# Altium project Sampler_DIOT.PrjPCB (part 3 of 5)

## Sheet Supply_Sampler.SchDoc: Power Supply
size 420 x 297 mm; Author: G.K.; CompanyName: WUT; DrawnBy: G.K.; Organization: CERN; Address1: Warsaw Univeristy of Technology; Address2: Nowowiejska 15/19; DocumentNumber: 5; Revision: -; SheetNumber: 5; SheetTotal: 5; EDA_Number: ARTIQ; Projet: Sampler; ModifiedBy: -; CreateDate: XX/XX/XXXX; CheckedDate: -; Title2: converters + LDOs; DivGrp: ISE; Designer: G.K.; ModifiedDate: -; ProjectName: Sampler
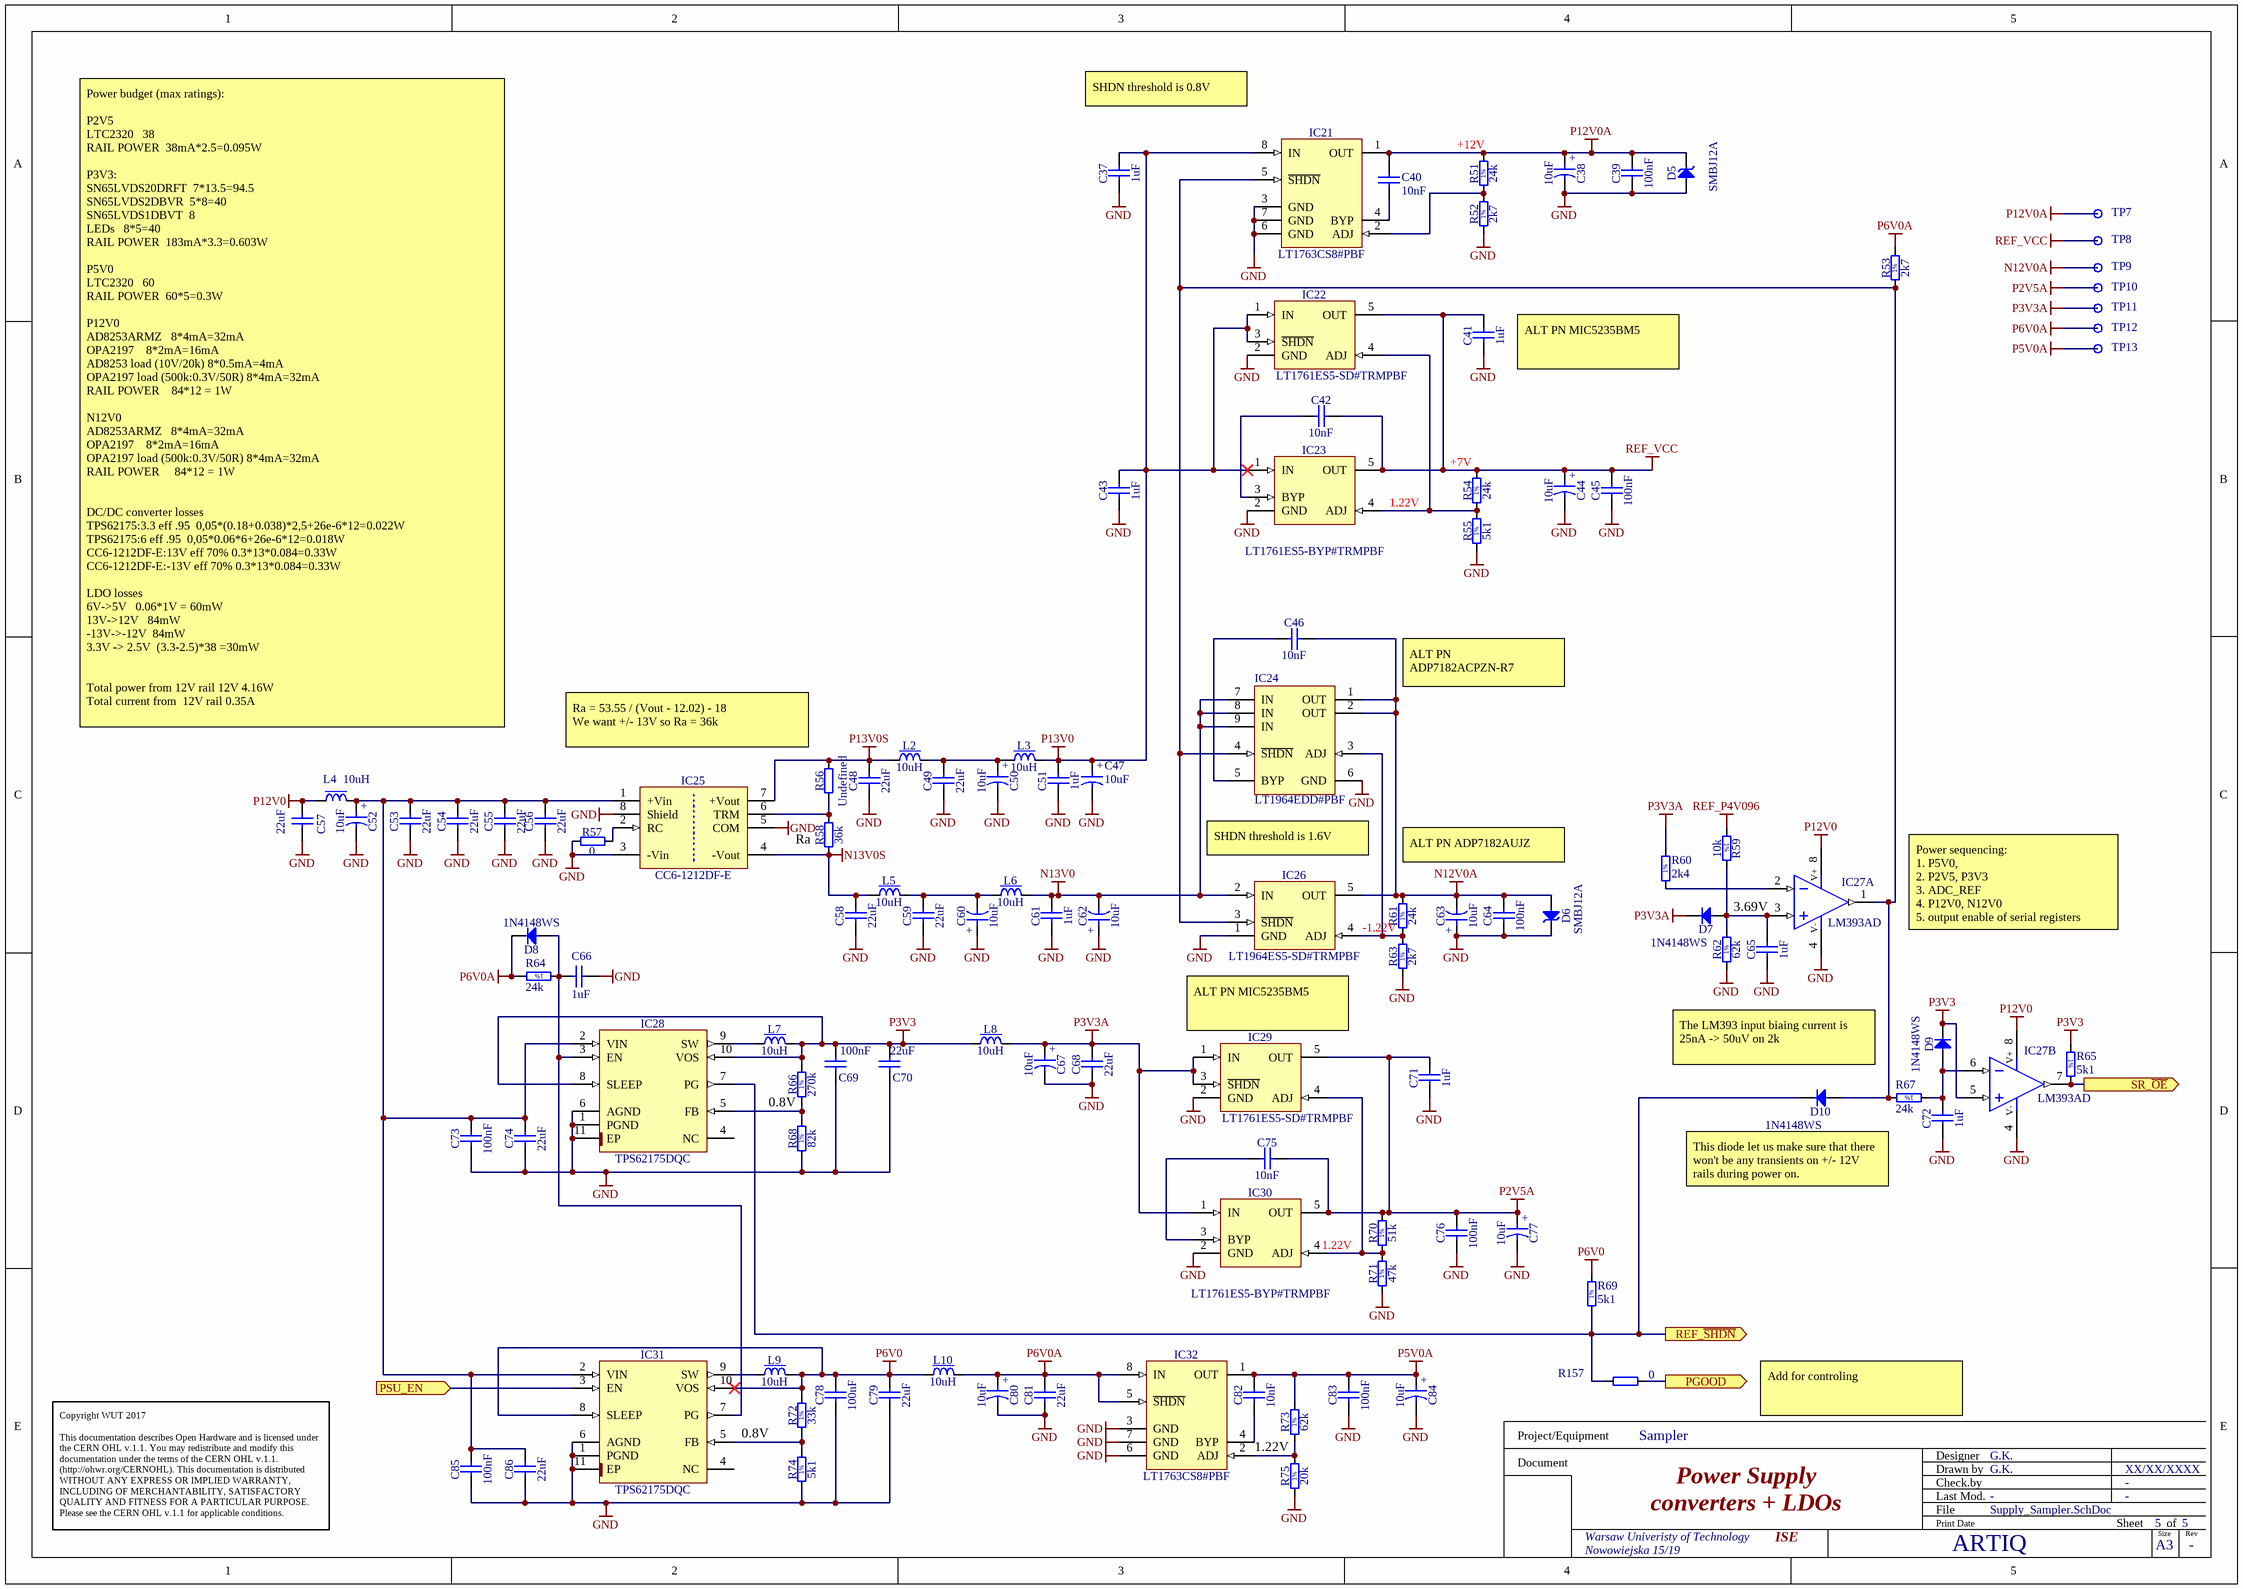
[diagram p3: Supply_Sampler.SchDoc]

### Parts
C37  1uF  [CAPC1608X87N]
C38  10uF  [CAPMP3216X180N]
C39  100nF  [CAPC1005X55N]
C40  10nF  [CAPC1608X87N]
C41  1uF  [CAPC1608X87N]
C42  10nF  [CAPC1608X87N]
C43  1uF  [CAPC1608X87N]
C44  10uF  [CAPMP3216X180N]
C45  100nF  [CAPC1005X55N]
C46  10nF  [CAPC1608X87N]
C47  10uF  [CAPMP3216X180N]
C48  22uF  [CAPC2012X135N]
C49  22uF  [CAPC2012X135N]
C50  10uF  [CAPMP3216X180N]
C51  1uF  [CAPC1608X87N]
C52  10uF  [CAPMP3216X180N]
C53  22uF  [CAPC2012X135N]
C54  22uF  [CAPC2012X135N]
C55  22uF  [CAPC2012X135N]
C56  22uF  [CAPC2012X135N]
C57  22uF  [CAPC2012X135N]
C58  22uF  [CAPC2012X135N]
C59  22uF  [CAPC2012X135N]
C60  10uF  [CAPMP3216X180N]
C61  1uF  [CAPC1608X87N]
C62  10uF  [CAPMP3216X180N]
C63  10uF  [CAPMP3216X180N]
C64  100nF  [CAPC1005X55N]
C65  1uF  [CAPC1608X87N]
C66  1uF  [CAPC1608X87N]
C67  10uF  [CAPMP3216X180N]
C68  22uF  [CAPC2012X135N]
C69  100nF  [CAPC1005X55N]
C70  22uF  [CAPC2012X135N]
C71  1uF  [CAPC1608X87N]
C72  1uF  [CAPC1608X87N]
C73  100nF  [CAPC1005X55N]
C74  22uF  [CAPC2012X135N]
C75  10nF  [CAPC1608X87N]
C76  100nF  [CAPC1005X55N]
C77  10uF  [CAPMP3216X180N]
C78  100nF  [CAPC1005X55N]
C79  22uF  [CAPC2012X135N]
C80  10uF  [CAPMP3216X180N]
C81  22uF  [CAPC2012X135N]
C82  10nF  [CAPC1608X87N]
C83  100nF  [CAPC1005X55N]
C84  10uF  [CAPMP3216X180N]
C85  100nF  [CAPC1005X55N]
C86  22uF  [CAPC2012X135N]
D5  SMBJ12A  [DIOM5336X265N]
D6  SMBJ12A  [DIOM5336X265N]
D7  1N4148WS  [SODFL2512X100N]
D8  1N4148WS  [SODFL2512X100N]
D9  1N4148WS  [SODFL2512X100N]
D10  1N4148WS  [SODFL2512X100N]
IC21  LT1763CS8#PBF  [SOIC127P600X175-8N]
IC22  LT1761ES5-SD#TRMPBF  [SOT95P280X100-5N]
IC23  LT1761ES5-BYP#TRMPBF  [SOT95P280X100-5N]
IC24  LT1964EDD#PBF  [LT-DD-8_V]
IC25  CC6-1212DF-E  [CC6-1212DF-E]
IC26  LT1964ES5-SD#TRMPBF  [SOT95P280X100-5N]
IC27  LM393AD  [SOIC127P600X175-8N]  (parts A,B of 2)
IC28  TPS62175DQC  [SON50P200X300X80-11N-R94X250]
IC29  LT1761ES5-SD#TRMPBF  [SOT95P280X100-5N]
IC30  LT1761ES5-BYP#TRMPBF  [SOT95P280X100-5N]
IC31  TPS62175DQC  [SON50P200X300X80-11N-R94X250]
IC32  LT1763CS8#PBF  [SOIC127P600X175-8N]
L2  10uH  [IND_MURATA-PS_8400]
L3  10uH  [IND_MURATA-PS_8400]
L4  10uH  [IND_MURATA-PS_8400]
L5  10uH  [IND_MURATA-PS_8400]
L6  10uH  [IND_MURATA-PS_8400]
L7  10uH  [IND_MURATA-PS_8400]
L8  10uH  [IND_MURATA-PS_8400]
L9  10uH  [IND_MURATA-PS_8400]
L10  10uH  [IND_MURATA-PS_8400]
R51  24k  [RESC1608X55N]
R52  2k7  [RESC1608X55N]
R53  2k7  [RESC1608X55N]
R54  24k  [RESC1608X55N]
R55  5k1  [RESC1005X40N]
R56  Undefined  [RESC1608X55N]
R57  0  [RESC1005X40N]
R58  36k  [RESC1608X55N]
R59  10k  [RESC1005X40N]
R60  2k4  [RESC1005X40N]
R61  24k  [RESC1608X55N]
R62  62k  [RESC1005X40N]
R63  2k7  [RESC1608X55N]
R64  24k  [RESC1608X55N]
R65  5k1  [RESC1005X40N]
R66  270k  [RESC1608X55N]
R67  24k  [RESC1608X55N]
R68  82k  [RESC1608X55N]
R69  5k1  [RESC1005X40N]
R70  51k  [RESC1005X40N]
R71  47k  [RESC1005X40N]
R72  33k  [RESC1005X40N]
R73  62k  [RESC1005X40N]
R74  5k1  [RESC1005X40N]
R75  20k  [RESC1005X40N]
R157  0  [RESC1005X40N]
TP7  Test Point  [TPS127]  (value not drawn)  (no BOM)
TP8  Test Point  [TPS127]  (value not drawn)  (no BOM)
TP9  Test Point  [TPS127]  (value not drawn)  (no BOM)
TP10  Test Point  [TPS127]  (value not drawn)  (no BOM)
TP11  Test Point  [TPS127]  (value not drawn)  (no BOM)
TP12  Test Point  [TPS127]  (value not drawn)  (no BOM)
TP13  Test Point  [TPS127]  (value not drawn)  (no BOM)

### Ports
PGOOD (out), PSU_EN (in), REF_~{SHDN} (out), SR_~{OE} (out)

### Nets
GND: C37.1 C38.2 C39.1 C41.1 C43.1 C44.2 C45.1 C47.2 C48.1 C49.1 C50.2 C51.1 C52.2 C53.1 C54.1 C55.1 C56.1 C57.1 C58.1 C59.1 C60.1 C61.1 C62.1 C63.1 C64.1 C65.1 C66.1 C67.2 C68.1 C69.1 C70.1 C71.1 C72.1 C73.1 C74.1 C76.1 C77.2 C78.1 C79.1 C80.2 C81.1 C83.1 C84.2 C85.1 C86.1 D5.2(A) D6.1(C) IC21.3(GND) IC21.6(GND) IC21.7(GND) IC22.2(GND) IC23.2(GND) IC24.6(GND) IC25.3(-Vin) IC25.5(COM) IC25.8(Shield) IC26.1(GND) IC27.4(V-) IC28.1(PGND) IC28.6(AGND) IC28.11(EP) IC29.2(GND) IC30.2(GND) IC31.1(PGND) IC31.6(AGND) IC31.11(EP) IC32.3(GND) IC32.6(GND) IC32.7(GND) R52.1 R55.1 R57.1 R62.1 R63.1 R68.1 R71.1 R74.1 R75.1
N12V0A: C46.2 C63.2 C64.2 D6.2(A) IC24.1(OUT) IC24.2(OUT) IC26.5(OUT) R61.2 TP9.1
N13V0: C61.2 C62.2 IC24.7(IN) IC24.8(IN) IC24.9(IN) IC26.2(IN) L6.2
N13V0S: C58.2 IC25.4(-Vout) L5.1 R58.1
P2V5A: C71.2 C75.2 C76.2 C77.1 IC29.5(OUT) IC30.5(OUT) R70.2 TP10.1
P3V3: C69.2 C70.2 D9.1(C) IC27.5(IN+) IC28.8(SLEEP) IC28.10(VOS) L7.2 L8.1 R65.1 R66.2
P3V3A: C67.1 C68.2 D7.1(C) IC29.1(IN) IC29.3(~{SHDN}) IC30.1(IN) L8.2 R60.2 TP11.1
P5V0A: C82.2 C83.2 C84.1 IC32.1(OUT) R73.2 TP13.1
P6V0: C78.2 C79.2 IC31.8(SLEEP) IC31.10(VOS) L9.2 L10.1 R69.2 R72.2
P6V0A: C80.1 C81.2 D8.1(C) IC32.5(~{SHDN}) IC32.8(IN) L10.2 R53.2 R64.2 TP12.1
P12V0: C57.2 IC27.8(V+) L4.1
P12V0A: C38.1 C39.2 C40.2 D5.1(C) IC21.1(OUT) R51.2 TP7.1
P13V0: C37.2 C43.2 C47.1 C51.2 IC21.8(IN) IC22.1(IN) IC22.3(~{SHDN}) IC23.1(IN) L3.2
P13V0S: C48.2 IC25.7(+Vout) L2.1 R56.2
REF_P4V096: R59.1
REF_VCC: C41.2 C42.2 C44.1 C45.2 IC22.5(OUT) IC23.5(OUT) R54.2 TP8.1
~{OE}: IC27.7(OUT) R65.2 ; port SR_~{OE}
PSU_EN: IC31.3(EN) ; port PSU_EN
NetC40_1: C40.1 IC21.4(BYP)
NetC42_1: C42.1 IC23.3(BYP)
NetC46_1: C46.1 IC24.5(BYP)
NetC49_2: C49.2 C50.1 L2.2 L3.1
NetC52_1: C52.1 C53.2 C54.2 C55.2 C56.2 C73.2 C74.2 C85.2 C86.2 IC25.1(+Vin) IC28.2(VIN) IC31.2(VIN) L4.2
NetC59_2: C59.2 C60.2 L5.2 L6.1
NetC65_2: C65.2 D7.2(A) IC27.3(IN+) R59.2 R62.2
NetC66_2: C66.2 D8.2(A) IC28.3(EN) IC31.7(PG) R64.1
NetC72_2: C72.2 D9.2(A) IC27.6(IN-) R67.1
NetC75_1: C75.1 IC30.3(BYP)
NetC82_1: C82.1 IC32.4(BYP)
NetD10_1: D10.1(C) IC28.7(PG) R69.1 R157.1 ; port REF_~{SHDN}
NetD10_2: D10.2(A) IC21.5(~{SHDN}) IC24.4(~{SHDN}) IC26.3(~{SHDN}) IC27.1(OUT) R53.1 R67.2
NetIC21_2: IC21.2(ADJ) R51.1 R52.2
NetIC22_4: IC22.4(ADJ) IC23.4(ADJ) R54.1 R55.2
NetIC24_3: IC24.3(ADJ) IC26.4(ADJ) R61.1 R63.2
NetIC25_2: IC25.2(RC) R57.2
NetIC25_6: IC25.6(TRM) R56.1 R58.2
NetIC27_2: IC27.2(IN-) R60.1
NetIC28_5: IC28.5(FB) R66.1 R68.2
NetIC28_9: IC28.9(SW) L7.1
NetIC29_4: IC29.4(ADJ) IC30.4(ADJ) R70.1 R71.2
NetIC31_5: IC31.5(FB) R72.1 R74.2
NetIC31_9: IC31.9(SW) L9.1
NetIC32_2: IC32.2(ADJ) R73.1 R75.2
NetR102_1: R157.2 ; port PGOOD

Not connected (* = marked no-connect by the designer): IC28 4(NC); IC31 4(NC)

### Notes on the sheet
- SHDN threshold is 0.8V
- (near R51) +12V
- (near C41) ALT PN MIC5235BM5
- (near IC23) 1.22V
- (near R54) +7V
- Power budget (max ratings):
  P2V5
  LTC2320			38
  RAIL POWER		38mA*2.5=0.095W
  P3V3:
  SN65LVDS20DRFT		7*13.5=94.5
  SN65LVDS2DBVR		5*8=40
  SN65LVDS1DBVT		8
  LEDs			8*5=40
  RAIL POWER		183mA*3.3=0.603W
  P5V0
  LTC2320			60
  RAIL POWER		60*5=0.3W
  P12V0
  AD8253ARMZ 		8*4mA=32mA
  OPA2197 			8*2mA=16mA
  AD8253 load (10V/20k)	8*0.5mA=4mA
  OPA2197 load (500k:0.3V/50R)	8*4mA=32mA
  RAIL POWER 		 84*12 = 1W
  N12V0
  AD8253ARMZ 		8*4mA=32mA
  OPA2197 			8*2mA=16mA
  OPA2197 load (500k:0.3V/50R)	8*4mA=32mA
  RAIL POWER  		 84*12 = 1W
  DC/DC converter losses
  TPS62175:3.3 eff .95		0,05*(0.18+0.038)*2,5+26e-6*12=0.022W
  TPS62175:6 eff .95		0,05*0.06*6+26e-6*12=0.018W
  CC6-1212DF-E:13V eff 70%	0.3*13*0.084=0.33W
  CC6-1212DF-E:-13V eff 70%	0.3*13*0.084=0.33W
  LDO losses
  6V->5V			0.06*1V = 60mW
  13V->12V			84mW
  -13V->-12V		84mW
  3.3V -> 2.5V		(3.3-2.5)*38 =30mW
  Total power from 12V rail	12V 4.16W
  Total current from  12V rail	0.35A
- ALT PN ADP7182ACPZN-R7
- (near R56) Ra = 53.55 / (Vout - 12.02) - 18
  We want +/- 13V so Ra = 36k
- (near R58) Ra
- SHDN threshold is 1.6V
- ALT PN ADP7182AUJZ
- -1.22V
- 3.69V
- Power sequencing:
  1. P5V0,
  2. P2V5, P3V3
  3. ADC_REF
  4. P12V0, N12V0
  5. output enable of serial registers
- ALT PN MIC5235BM5
- The LM393 input biaing current is 25nA -> 50uV on 2k
- (near R66) 0.8V
- This diode let us make sure that there won't be any transients on +/- 12V rails during power on.
- 1.22V
- 0.8V
- Add for controling
- Copyright WUT 2017
  This documentation describes Open Hardware and is licensed under the CERN OHL v.1.1. You may redistribute and modify this documentation under the terms of the CERN OHL v.1.1. (http://ohwr.org/CERNOHL). This documentation is distributed WITHOUT ANY EXPRESS OR IMPLIED WARRANTY, INCLUDING OF MERCHANTABILITY, SATISFACTORY QUALITY AND FITNESS FOR A PARTICULAR PURPOSE. Please see the CERN OHL v.1.1 for applicable conditions.
- Project/Equipment
- Document
- Designer
- Drawn by
- Check.by
- File
- Last Mod.
- Print Date
- Sheet
- Size
- A3
- of
- Rev
- (in symbol CTE3216-18_10UF_16V_20%_AVX_TCJ) +
- (in symbol R0402_2K4_1%_0.0625W_100PPM) 1%
- (in symbol R0402_5K1_1%_0.0625W_100PPM) 1%
- (in symbol R0402_10K_1%_0.0625W_100PPM) 1%
- (in symbol R0402_20K_1%_0.0625W_100PPM) 1%
- (in symbol R0402_33K_1%_0.0625W_100PPM) 1%
- (in symbol R0402_47K_1%_0.0625W_100PPM) 1%
- (in symbol R0402_51K_1%_0.0625W_100PPM) 1%
- (in symbol R0402_62K_1%_0.0625W_100PPM) 1%
- (in symbol R0603_2K7_1%_0.1W_100PPM) 1%
- (in symbol R0603_24K_1%_0.1W_100PPM) 1%
- (in symbol R0603_82K_1%_0.1W_100PPM) 1%
- (in symbol R0603_270K_1%_0.1W_100PPM) 1%

### Library data of the parts
C37 C41 C43 C51 C61 C65 C66 C71 C72 = CC0603_1UF_25V_10%_X7R: Non-polarised capacitor; Part Description: SMD Multilayer Chip Ceramic Capacitor; Manufacturer: GENERIC; Manufacturer1 Part Number: GRM188R71E105KA12D; Voltage: 25V; TC: X7R; Tolerance: ±10%; Part Number: CC0603_1UF_25V_10%_X7R; Component Kind: Standard; Component Type: Standard; Pin Count: 2; Value: 1uF; Status: None; Manufacturer Part Number: CC0603_1UF_25V_10%_X7R; Case: 0603; Mounted: Yes; Socket: No; SMD: Yes; Sense: No; Manufacturer1 Example: MURATA; Manufacturer1 ComponentHeight: 0.9mm; HelpURL: \\cern.ch\dfs\Applications\Altium\Datasheets\CC0603_X7R_MURATA.pdf; Author: CERN DEM JLC; CreateDate: 18.01.2011; LatestRevisionDate: 18.01.2011
C38 C44 C47 C50 C52 C60 C62 C63 C67 C77 C80 C84 = CTE3216-18_10UF_16V_20%_AVX_TCJ: Polarised capacitor; Part Description: ESR 0R200 Tantalum Solid Electrolytic Chip Capacitor with Conductive Polymer Electrode; Manufacturer: AVX; Manufacturer Part Number: TCJA106M016R0200; Voltage: 16V; Tolerance: ±20%; Part Number: CTE3216-18_10UF_16V_20%_AVX_TCJ; Component Kind: Standard; Component Type: Standard; Pin Count: 2; Value: 10uF; Status: Preferred; Case: A; Mounted: Yes; Socket: No; SMD: Yes; Sense: No; ComponentHeight: 1.8mm; HelpURL: \\cern.ch\dfs\Applications\Altium\Datasheets\CTE_AVX_TCJ.pdf; Author: CERN DEM JLC; CreateDate: 29.03.2012; LatestRevisionDate: 29.03.2012
C39 C45 C64 C69 C73 C76 C78 C83 C85 = CC0402_100NF_16V_10%_X5R: Non-polarised capacitor; Part Description: SMD Multilayer Chip Ceramic Capacitor; Manufacturer: GENERIC; Manufacturer1 Part Number: GRM155R61C104KA88D; Voltage: 16V; TC: X5R; Tolerance: ±10%; Part Number: CC0402_100NF_16V_10%_X5R; Component Kind: Standard; Component Type: Standard; Pin Count: 2; Value: 100nF; Status: None; Manufacturer Part Number: CC0402_100NF_16V_10%_X5R; Case: 0402; Mounted: Yes; Socket: No; SMD: Yes; Sense: No; Manufacturer1 Example: MURATA; Manufacturer1 ComponentHeight: 0.55mm; HelpURL: \\cern.ch\dfs\Applications\Altium\Datasheets\CC0402_X5R_MURATA_GRM.pdf; Author: CERN DEM JLC; CreateDate: 10.12.2013; LatestRevisionDate: 10.12.2013
C40 C42 C46 C75 C82 = CC0603_10NF_50V_10%_X7R: Non-polarised capacitor; Part Description: SMD Multilayer Chip Ceramic Capacitor; Manufacturer: GENERIC; Manufacturer1 Part Number: 223858615636; Voltage: 50V; TC: X7R; Tolerance: ±10%; Part Number: CC0603_10NF_50V_10%_X7R; Component Kind: Standard; Component Type: Standard; Pin Count: 2; Value: 10nF; Status: Preferred; Manufacturer Part Number: CC0603_10NF_50V_10%_X7R; Case: 0603; Mounted: Yes; Socket: No; SMD: Yes; Sense: No; Manufacturer1 Example: PHYCOMP; Manufacturer1 ComponentHeight: 0.87mm; HelpURL: \\cern.ch\dfs\Applications\Altium\Datasheets\CC0603_X7R_PHYCOMP.pdf; Author: CERN DEM JLC; CreateDate: 03.12.2007; LatestRevisionDate: 03.12.2007
C48 C49 C53-C59 C68 C70 C74 C79 C81 C86 = CC0805_22UF_16V_10%_X5R: Non-polarised capacitor; Part Description: SMD Multilayer Chip Ceramic Capacitor; Manufacturer: GENERIC; Manufacturer1 Part Number: C2012X5R1C226KT; Voltage: 16V; TC: X5R; Tolerance: ±10%; Part Number: CC0805_22UF_16V_10%_X5R; Component Kind: Standard; Component Type: Standard; Pin Count: 2; Value: 22uF; Status: Preferred; Manufacturer Part Number: CC0805_22UF_16V_10%_X5R; Case: 0805; Mounted: Yes; Socket: No; SMD: Yes; Sense: No; Manufacturer1 Example: TDK; Manufacturer1 ComponentHeight: 1.35mm; HelpURL: \\cern.ch\dfs\Applications\Altium\Datasheets\CC0805_X5R_TDK_C.pdf; Author: CERN DEM JLC; CreateDate: 25.10.2012; LatestRevisionDate: 25.10.2012
D5 D6 = SMBJ12A: Zener Diode; Part Description: Uni-Directional Transient Voltage Suppressor Diode; Manufacturer: FAIRCHILD SEMICONDUCTOR; Voltage: 12V; Power: 600W; PressFit: No; Bonding: No; Part Number: SMBJ12A; Component Kind: Standard; Component Type: Standard; Device: SMBJ12A; PackageDescription: DO-214-AA/SMB Diode, Molded Body; 5.34mm L X 3.625mm W X 2.65mm H, IPC Medium Density; Manufacturer Part Number: SMBJ12A; Pin Count: 2; Case: DO-214AA; Mounted: Yes; Socket: No; SMD: Yes; Sense: No; ComponentHeight: 2.65mm; HelpURL: \\cern.ch\dfs\Applications\Altium\Datasheets\SMBJ.pdf; Author: CERN DEM JLC; CreateDate: 10.04.2013; LatestRevisionDate: 10.04.2013
D7-D10 = 1N4148WS: Diode; Part Description: Small Signal Diodes; Manufacturer: FAIRCHILD SEMICONDUCTOR; Voltage: 75V; Power: 150mA; PressFit: No; Bonding: No; Part Number: 1N4148WS; Component Kind: Standard; Component Type: Standard; Device: 1N4148WS; PackageDescription: SODFL Diode; 1.70mm W X 1.25mm L X 1.00mm H body, IPC Medium Density; Manufacturer Part Number: 1N4148WS; Pin Count: 2; Case: SOD-323F; Mounted: Yes; Socket: No; SMD: Yes; Sense: No; ComponentHeight: 1mm; HelpURL: \\cern.ch\dfs\Applications\Altium\Datasheets\1N4148WS.pdf; Author: CERN DEM JLC; CreateDate: 12.05.2011; LatestRevisionDate: 12.05.2011
IC21 IC32 = LT1763CS8#PBF: 1.22V to 20V 500mA, Low Noise, LDO Adjustable Micropower Regulator; Manufacturer: LINEAR TECHNOLOGY; PressFit: No; Bonding: No; Part Number: LT1763CS8#PBF; Component Kind: Standard; Component Type: Standard; Device: LT1763CS8#PBF; PackageDescription: SOIC 8, Pitch 1.27mm, Body 4x5mm, IPC Medium Density; Part Description: 1.22V to 20V 500mA, Low Noise, LDO Adjustable Micropower Regulator; Manufacturer Part Number: LT1763CS8#PBF; Pin Count: 8; Case: SOIC8; Mounted: Yes; Socket: No; SMD: Yes; Sense: No; ComponentHeight: 1.75mm; HelpURL: \\cern.ch\dfs\Applications\Altium\Datasheets\LT1763CS8#PBF.pdf; Author: CERN DEM JLC; CreateDate: 11.01.2010; LatestRevisionDate: 11.01.2010
IC22 IC29 = LT1761ES5-SD#TRMPBF: 100mA, Low Noise, LDO Micropower Adjustable Regulator in SOT-23; Part Description: 1.22V to 20V, 100mA, Low Noise, LDO Adjustable Micropower Regulator; Manufacturer: LINEAR TECHNOLOGY; PressFit: No; Bonding: No; Part Number: LT1761ES5-SD#TRMPBF; Component Kind: Standard; Component Type: Standard; Device: LT1761ES5-SD#TRMPBF; PackageDescription: SOT23, 0.95mm Pitch; 5 Pin, 1.60mm W X 2.90mm L X 1.00mm H body, IPC Medium Density; Manufacturer Part Number: LT1761ES5-SD#TRMPBF; Pin Count: 5; Case: SOT23-5; Mounted: Yes; Socket: No; SMD: Yes; Sense: No; ComponentHeight: 1mm; HelpURL: \\cern.ch\dfs\Applications\Altium\Datasheets\LT1761ES5-SD#TRMPBF.pdf; Author: CERN DEM JLC; CreateDate: 26.08.2013; LatestRevisionDate: 26.08.2013
IC23 IC30 = LT1761ES5-BYP#TRMPBF: 100mA, Low Noise, LDO Micropower Adjustable Regulator in SOT-23; Part Description: 1.22V to 20V, 100mA, Low Noise, LDO Adjustable Micropower Regulator; Manufacturer: LINEAR TECHNOLOGY; PressFit: No; Bonding: No; Part Number: LT1761ES5-BYP#TRMPBF; Component Kind: Standard; Component Type: Standard; Device: LT1761ES5-BYP#TRMPBF; PackageDescription: SOT23, 0.95mm pitch; 5 pin, 1.6mm W X 2.9mm L, IPC Medium Density; Manufacturer Part Number: LT1761ES5-BYP#TRMPBF; Pin Count: 5; Case: SOT23; Mounted: Yes; Socket: No; SMD: Yes; Sense: No; ComponentHeight: 1mm; HelpURL: \\cern.ch\dfs\Applications\Altium\Datasheets\LT1761ES5-SD#TRMPBF.pdf; Author: CERN DEM MR; CreateDate: 17.02.2016; LatestRevisionDate: 17.02.2016
IC24 = CMP-0476-00219-1: 200 mA, Low Noise, Low Dropout Negative Micropower Regulator, -1.9 to -20 V Vin, Adjustable Vout, 8-pin SON (DD-8), -40 to 125 degC, Pb-Free; Manufacturer: Linear Technology; Output Voltage: Adj; Isupply(mA): 0.03; Dropout Voltage(V): 0.34; Vout Max(V): -1.22; Shutdown Current(uA): 3; Noise(uV): 30; Discrete Pass Element: no; Iout(mA): 200; Number of Outputs: 1; PSRR(dB): 54; ComponentLink3Description: Package Specification; PackageDescription: 8-Pin Plastic DFN, Body 3 x 3 mm, Pitch 0.5 mm; RoHS: TRUE; ComponentLink1Description: Manufacturer URL; Vin Max(V): -1.9; Vout Min(V): -20; Code_JEDEC: MO-229; ComponentLink1URL: http://www.linear.com/; PartNumber: LT1964EDD#PBF; PackageVersion: Jun-10; DatasheetVersion: Rev. B; PackageReference: DD-8; ComponentLink2Description: Datasheet; Vin Min(V): -20; ComponentLink3URL: http://cds.linear.com/docs/en/packaging/DFN_8_05-08-1698.pdf; ComponentLink2URL: http://cds.linear.com/docs/en/datasheet/1964fb.pdf; Mounting Technology: Surface Mount
IC25 = DC/DC_CC6-1212DF-E: CONV DC/DC 6W DUAL 12V +-12V PCB; Manufacturer: TDK-Lambda Americas Inc.; PressFit: No; Bonding: No; Part Number: CC6-1212DF-E; Component Kind: Standard; Component Type: Standard; Device: CC6-1212DF-E; PackageDescription: CC6 Series, Body 0.900 x 0.831 x 0.335, Regulated; Part Description: CONV DC/DC 6W DUAL 12V +-12V PCB; Manufacturer Part Number: CC6-1212DF-E; Pin Count: 7; Mounted: Yes; Socket: No; SMD: No; Sense: No; ComponentHeight: 10.45mm; Author: GK; CreateDate: 17.12.2016; LatestRevisionDate: 17.12.2016
IC26 = LT1964ES5-SD#TRMPBF: 200mA, Low Noise, Low Dropout Negative Micropower Regulator; Part Description: -1.22V to -20V, 200mA, Low Noise, Low Dropout Negative Micropower Regulator; Manufacturer: LINEAR TECHNOLOGY; PressFit: No; Bonding: No; Part Number: LT1964ES5-SD#TRMPBF; Component Kind: Standard; Component Type: Standard; Device: LT1964ES5-SD#TRMPBF; PackageDescription: SOT23, 0.95mm pitch; 5 pin, 1.75mm W X 3.00mm L, IPC Medium Density; Manufacturer Part Number: LT1964ES5-SD#TRMPBF; Pin Count: 5; Case: SOT23-5; Mounted: Yes; Socket: No; SMD: Yes; Sense: No; ComponentHeight: 1mm; HelpURL: \\cern.ch\dfs\Applications\Altium\Datasheets\LT1964ES5-SD#TRMPBF.pdf; Author: CERN DEM JLC; CreateDate: 05.05.2009; LatestRevisionDate: 05.05.2009
IC27 = LM393AD: Dual Operational Amplifier; Part Description: Dual Differential Comparator; Manufacturer: TEXAS INSTRUMENTS; PressFit: No; Bonding: No; Part Number: LM393AD; Component Kind: Standard; Component Type: Standard; Device: LM393AD; PackageDescription: SOIC 8, Pitch 1.27mm - Body 4x5mm, IPC Medium Density; Manufacturer Part Number: LM393AD; Pin Count: 8; Case: SOIC8; Mounted: Yes; Socket: No; SMD: Yes; Sense: No; ComponentHeight: 1.75mm; Author: CERN DEM JLC; HelpURL: \\cern.ch\dfs\Applications\Altium\Datasheets\LM393AD.pdf; CreateDate: 22.10.2013; LatestRevisionDate: 22.10.2013
IC28 IC31 = TPS62175DQC: 4.75-28VDC to 1-6VDC, 500mA Step-Down Converter With Sleep Mode; Manufacturer: TEXAS INSTRUMENTS; PressFit: No; Bonding: No; Part Number: TPS62175DQC; Component Kind: Standard; Component Type: Standard; Device: TPS62175DQC; PackageDescription: SON, 10-Leads, Body 2x3mm, Pitch 0.5mm, Thermal Pad 0.94x2.5mm, IPC Medium Density; Part Description: 4.75-28VDC to 1-6VDC, 500mA Step-Down Converter With Sleep Mode; Manufacturer Part Number: TPS62175DQC; Pin Count: 11; Case: SON10; Mounted: Yes; Socket: No; SMD: Yes; Sense: No; ComponentHeight: 0.8mm; HelpURL: \\cern.ch\dfs\Applications\Altium\Datasheets\TPS62175DQC.pdf; Author: CERN DEM JMW; CreateDate: 11.08.2015; LatestRevisionDate: 11.08.2015
L2-L10 = IND_10UH_10%_MURATA-PS_8400: Inductor With Core; Part Description: Miniature Surface Mount Power Inductor (8400 Serie); Manufacturer: MURATA POWER SOLUTIONS; Manufacturer Part Number: 84103C; Power: 950mA; Resistance: 0.24R; Tolerance: ±10%; Part Number: IND_10UH_10%_MURATA-PS_8400; Component Kind: Standard; Component Type: Standard; Pin Count: 2; Value: 10uH; Status: None; Mounted: Yes; Socket: No; SMD: Yes; Sense: No; ComponentHeight: 2.9mm; HelpURL: \\cern.ch\dfs\Applications\Altium\Datasheets\IND_MURATA-PS_8400.pdf; Author: CERN DEM JLC; CreateDate: 02.07.2012; LatestRevisionDate: 02.07.2012
R51 R54 R61 R64 R67 = R0603_24K_1%_0.1W_100PPM: Resistor - 1%; Part Description: General Purpose Thick Film Chip Resistor; Manufacturer: GENERIC; Manufacturer1 Part Number: NRC06F2402TRF; Power: 0.1W; TC: ±100ppm/°C; Part Number: R0603_24K_1%_0.1W_100PPM; Component Kind: Standard; Component Type: Standard; Pin Count: 2; Value: 24k; Status: Preferred; Tolerance: ±1%; Manufacturer Part Number: R0603_24K_1%_0.1W_100PPM; Case: 0603; Mounted: Yes; Sense: No; Socket: No; SMD: Yes; Manufacturer1 Example: NIC COMPONENT; Manufacturer1 ComponentHeight: 0.55mm; HelpURL: \\cern.ch\dfs\Applications\Altium\Datasheets\R0603_NIC_NRC.pdf; Author: CERN DEM JLC; CreateDate: 03.12.2007; LatestRevisionDate: 13.03.2008
R52 R53 R63 = R0603_2K7_1%_0.1W_100PPM: Resistor - 1%; Part Description: General Purpose Thick Film Chip Resistor; Manufacturer: GENERIC; Manufacturer1 Part Number: RC0603FR-072K7L; Power: 0.1W; TC: ±100ppm/°C; Part Number: R0603_2K7_1%_0.1W_100PPM; Component Kind: Standard; Component Type: Standard; Pin Count: 2; Value: 2k7; Status: Preferred; Tolerance: ±1%; Manufacturer Part Number: R0603_2K7_1%_0.1W_100PPM; Case: 0603; Mounted: Yes; Sense: No; Socket: No; SMD: Yes; Manufacturer1 Example: YAGEO PHYCOMP; Manufacturer1 ComponentHeight: 0.55mm; HelpURL: \\cern.ch\dfs\Applications\Altium\Datasheets\R0603_PHYCOMP_RC0603.pdf; Author: CERN DEM JLC; CreateDate: 02.05.2011; LatestRevisionDate: 02.05.2011
R55 R65 R69 R74 = R0402_5K1_1%_0.0625W_100PPM: Resistor - 1%; Part Description: General Purpose Thick Film Chip Resistor; Manufacturer: GENERIC; Manufacturer1 Part Number: 232270675102L; TC: ±100ppm/°C; PressFit: No; Part Number: R0402_5K1_1%_0.0625W_100PPM; Component Kind: Standard; Component Type: Standard; Pin Count: 2; Value: 5k1; Status: Not Recommended; Power: 0.0625W; Tolerance: ±1%; Manufacturer Part Number: R0402_5K1_1%_0.0625W_100PPM; Case: 0402; Mounted: Yes; Sense: No; Socket: No; SMD: Yes; Manufacturer1 Example: YAGEO PHYCOMP; Manufacturer1 ComponentHeight: 0.4mm; HelpURL: \\cern.ch\dfs\Applications\Altium\Datasheets\R0402_Phycomp_RC0402.pdf; Author: CERN DEM JLC; CreateDate: 03.12.2007; LatestRevisionDate: 17.10.2012
R56 = R0603_NO-VALUE: Resistor; Part Description: Reserved Footprint For a 0603 (1608) Chip Resistor; Mounted: No; Part Number: R0603_NO-VALUE; Component Kind: Standard; Component Type: Standard; Pin Count: 2; Value: Undefined; Status: None; Manufacturer: Undefined; Manufacturer Part Number: R0603_NO-VALUE; Case: 0603; Sense: No; Socket: No; SMD: Yes; Manufacturer1 Example: Undefined; Manufacturer1 Part Number: Undefined; Manufacturer1 ComponentHeight: Undefined; HelpURL: Undefined; Author: CERN DEM JLC; CreateDate: 03.12.2007; LatestRevisionDate: 13.03.2008
R57 = R0402_0R_JUMPER: Resistor; Part Description: 1A (0.05R Max DC Resistance) Zero Ohm Jumper; Manufacturer: GENERIC; Manufacturer1 Part Number: 232270591001L; Part Number: R0402_0R_JUMPER; Component Kind: Standard; Component Type: Standard; Pin Count: 2; Value: 0; Status: Not recommended; Manufacturer Part Number: R0402_0R_JUMPER; Case: 0402; Mounted: Yes; Sense: No; Socket: No; SMD: Yes; Manufacturer1 Example: YAGEO PHYCOMP; Manufacturer1 ComponentHeight: 0.4mm; HelpURL: \\cern.ch\dfs\Applications\Altium\Datasheets\R0402_Phycomp_RC0402.pdf; Author: CERN DEM JLC; CreateDate: 03.12.2007; LatestRevisionDate: 17.10.2012
R58 = R0603_36k_1%_0.1W_100PPM: Resistor - 1%; Part Description: General Purpose Thick Film Chip Resistor; Manufacturer: GENERIC; Manufacturer1 Part Number: NRC06F3602TRF; Power: 0.1W; TC: ±100ppm/°C; PressFit: No; Part Number: R0603_36K_1%_0.1W_100PPM; Component Kind: Standard; Component Type: Standard; Pin Count: 2; Value: 36k; Status: Preferred; Tolerance: ±1%; Manufacturer Part Number: R0603_36K_1%_0.1W_100PPM; Case: 0603; Mounted: Yes; Sense: No; Socket: No; SMD: Yes; Manufacturer1 Example: NIC COMPONENT; Manufacturer1 ComponentHeight: 0.55mm; HelpURL: \\cern.ch\dfs\Applications\Altium\Datasheets\R0603_NIC_NRC.pdf; Author: CERN DEM JLC; CreateDate: 03.12.2007; LatestRevisionDate: 13.03.2008
R59 = R0402_10K_1%_0.0625W_100PPM: Resistor - 1%; Part Description: General Purpose Thick Film Chip Resistor; Manufacturer: GENERIC; Manufacturer1 Part Number: 232270671003L; TC: ±100ppm/°C; PressFit: No; Part Number: R0402_10K_1%_0.0625W_100PPM; Component Kind: Standard; Component Type: Standard; Pin Count: 2; Value: 10k; Status: Not Recommended; Power: 0.0625W; Tolerance: ±1%; Manufacturer Part Number: R0402_10K_1%_0.0625W_100PPM; Case: 0402; Mounted: Yes; Sense: No; Socket: No; SMD: Yes; Manufacturer1 Example: YAGEO PHYCOMP; Manufacturer1 ComponentHeight: 0.4mm; HelpURL: \\cern.ch\dfs\Applications\Altium\Datasheets\R0402_Phycomp_RC0402.pdf; Author: CERN DEM JLC; CreateDate: 03.12.2007; LatestRevisionDate: 17.10.2012
R60 = R0402_2K4_1%_0.0625W_100PPM: Resistor - 1%; Part Description: General Purpose Thick Film Chip Resistor; Manufacturer: GENERIC; Manufacturer1 Part Number: 232270672402L; TC: ±100ppm/°C; PressFit: No; Part Number: R0402_2K4_1%_0.0625W_100PPM; Component Kind: Standard; Component Type: Standard; Pin Count: 2; Value: 2k4; Status: Not Recommended; Power: 0.0625W; Tolerance: ±1%; Manufacturer Part Number: R0402_2K4_1%_0.0625W_100PPM; Case: 0402; Mounted: Yes; Sense: No; Socket: No; SMD: Yes; Manufacturer1 Example: YAGEO PHYCOMP; Manufacturer1 ComponentHeight: 0.4mm; HelpURL: \\cern.ch\dfs\Applications\Altium\Datasheets\R0402_Phycomp_RC0402.pdf; Author: CERN DEM JLC; CreateDate: 03.12.2007; LatestRevisionDate: 17.10.2012
R62 R73 = R0402_62K_1%_0.0625W_100PPM: Resistor - 1%; Part Description: General Purpose Thick Film Chip Resistor; Manufacturer: GENERIC; Manufacturer1 Part Number: 232270676203L; TC: ±100ppm/°C; PressFit: No; Part Number: R0402_62K_1%_0.0625W_100PPM; Component Kind: Standard; Component Type: Standard; Pin Count: 2; Value: 62k; Status: Not Recommended; Power: 0.0625W; Tolerance: ±1%; Manufacturer Part Number: R0402_62K_1%_0.0625W_100PPM; Case: 0402; Mounted: Yes; Sense: No; Socket: No; SMD: Yes; Manufacturer1 Example: YAGEO PHYCOMP; Manufacturer1 ComponentHeight: 0.4mm; HelpURL: \\cern.ch\dfs\Applications\Altium\Datasheets\R0402_Phycomp_RC0402.pdf; Author: CERN DEM JLC; CreateDate: 03.12.2007; LatestRevisionDate: 17.10.2012
R66 = R0603_270K_1%_0.1W_100PPM: Resistor - 1%; Part Description: General Purpose Thick Film Chip Resistor; Manufacturer: GENERIC; Manufacturer1 Part Number: NRC06F2703TRF; Power: 0.1W; TC: ±100ppm/°C; Part Number: R0603_270K_1%_0.1W_100PPM; Component Kind: Standard; Component Type: Standard; Pin Count: 2; Value: 270k; Status: Preferred; Tolerance: ±1%; Manufacturer Part Number: R0603_270K_1%_0.1W_100PPM; Case: 0603; Mounted: Yes; Sense: No; Socket: No; SMD: Yes; Manufacturer1 Example: NIC COMPONENT; Manufacturer1 ComponentHeight: 0.55mm; HelpURL: \\cern.ch\dfs\Applications\Altium\Datasheets\R0603_NIC_NRC.pdf; Author: CERN DEM JLC; CreateDate: 03.12.2007; LatestRevisionDate: 13.03.2008
R68 = R0603_82K_1%_0.1W_100PPM: Resistor - 1%; Part Description: General Purpose Thick Film Chip Resistor; Manufacturer: GENERIC; Manufacturer1 Part Number: NRC06F8202TRF; Power: 0.1W; TC: ±100ppm/°C; Part Number: R0603_82K_1%_0.1W_100PPM; Component Kind: Standard; Component Type: Standard; Pin Count: 2; Value: 82k; Status: Preferred; Tolerance: ±1%; Manufacturer Part Number: R0603_82K_1%_0.1W_100PPM; Case: 0603; Mounted: Yes; Sense: No; Socket: No; SMD: Yes; Manufacturer1 Example: NIC COMPONENT; Manufacturer1 ComponentHeight: 0.55mm; HelpURL: \\cern.ch\dfs\Applications\Altium\Datasheets\R0603_NIC_NRC.pdf; Author: CERN DEM JLC; CreateDate: 03.12.2007; LatestRevisionDate: 13.03.2008
R70 = R0402_51K_1%_0.0625W_100PPM: Resistor - 1%; Part Description: General Purpose Thick Film Chip Resistor; Manufacturer: GENERIC; Manufacturer1 Part Number: 232270675103L; TC: ±100ppm/°C; PressFit: No; Part Number: R0402_51K_1%_0.0625W_100PPM; Component Kind: Standard; Component Type: Standard; Pin Count: 2; Value: 51k; Status: Not Recommended; Power: 0.0625W; Tolerance: ±1%; Manufacturer Part Number: R0402_51K_1%_0.0625W_100PPM; Case: 0402; Mounted: Yes; Sense: No; Socket: No; SMD: Yes; Manufacturer1 Example: YAGEO PHYCOMP; Manufacturer1 ComponentHeight: 0.4mm; HelpURL: \\cern.ch\dfs\Applications\Altium\Datasheets\R0402_Phycomp_RC0402.pdf; Author: CERN DEM JLC; CreateDate: 03.12.2007; LatestRevisionDate: 17.10.2012
R71 = R0402_47K_1%_0.0625W_100PPM: Resistor - 1%; Part Description: General Purpose Thick Film Chip Resistor; Manufacturer: GENERIC; Manufacturer1 Part Number: 232270674703L; TC: ±100ppm/°C; PressFit: No; Part Number: R0402_47K_1%_0.0625W_100PPM; Component Kind: Standard; Component Type: Standard; Pin Count: 2; Value: 47k; Status: Not Recommended; Power: 0.0625W; Tolerance: ±1%; Manufacturer Part Number: R0402_47K_1%_0.0625W_100PPM; Case: 0402; Mounted: Yes; Sense: No; Socket: No; SMD: Yes; Manufacturer1 Example: YAGEO PHYCOMP; Manufacturer1 ComponentHeight: 0.4mm; HelpURL: \\cern.ch\dfs\Applications\Altium\Datasheets\R0402_Phycomp_RC0402.pdf; Author: CERN DEM JLC; CreateDate: 03.12.2007; LatestRevisionDate: 17.10.2012
R72 = R0402_33K_1%_0.0625W_100PPM: Resistor - 1%; Part Description: General Purpose Thick Film Chip Resistor; Manufacturer: GENERIC; Manufacturer1 Part Number: 232270673303L; TC: ±100ppm/°C; PressFit: No; Part Number: R0402_33K_1%_0.0625W_100PPM; Component Kind: Standard; Component Type: Standard; Pin Count: 2; Value: 33k; Status: Not Recommended; Power: 0.0625W; Tolerance: ±1%; Manufacturer Part Number: R0402_33K_1%_0.0625W_100PPM; Case: 0402; Mounted: Yes; Sense: No; Socket: No; SMD: Yes; Manufacturer1 Example: YAGEO PHYCOMP; Manufacturer1 ComponentHeight: 0.4mm; HelpURL: \\cern.ch\dfs\Applications\Altium\Datasheets\R0402_Phycomp_RC0402.pdf; Author: CERN DEM JLC; CreateDate: 03.12.2007; LatestRevisionDate: 17.10.2012
R75 = R0402_20K_1%_0.0625W_100PPM: Resistor - 1%; Part Description: General Purpose Thick Film Chip Resistor; Manufacturer: GENERIC; Manufacturer1 Part Number: 232270672003L; TC: ±100ppm/°C; PressFit: No; Part Number: R0402_20K_1%_0.0625W_100PPM; Component Kind: Standard; Component Type: Standard; Pin Count: 2; Value: 20k; Status: Not Recommended; Power: 0.0625W; Tolerance: ±1%; Manufacturer Part Number: R0402_20K_1%_0.0625W_100PPM; Case: 0402; Mounted: Yes; Sense: No; Socket: No; SMD: Yes; Manufacturer1 Example: YAGEO PHYCOMP; Manufacturer1 ComponentHeight: 0.4mm; HelpURL: \\cern.ch\dfs\Applications\Altium\Datasheets\R0402_Phycomp_RC0402.pdf; Author: CERN DEM JLC; CreateDate: 03.12.2007; LatestRevisionDate: 17.10.2012
R157 = R0402_0R_JUMPER: Resistor; Part Description: 1A (0.05R Max DC Resistance) Zero Ohm Jumper; Manufacturer: GENERIC; Manufacturer1 Part Number: 232270591001L; PressFit: No; Part Number: R0402_0R_JUMPER; Component Kind: Standard; Component Type: Standard; Pin Count: 2; Value: 0; Status: Not Recommended; Manufacturer Part Number: R0402_0R_JUMPER; Case: 0402; Mounted: Yes; Sense: No; Socket: No; SMD: Yes; Manufacturer1 Example: YAGEO PHYCOMP; Manufacturer1 ComponentHeight: 0.4mm; HelpURL: \\cern.ch\dfs\Applications\Altium\Datasheets\R0402_Phycomp_RC0402.pdf; Author: CERN DEM JLC; CreateDate: 03.12.2007; LatestRevisionDate: 17.10.2012
TP7-TP13 = SMD_PAD_1.27X1.27MM: Part Description: 1.27mm x 1.27mm PCB Copper Area (SMD Test Point); Mounted: No; Part Number: SMD_PAD_1.27X1.27MM; Component Type: Standard (No BOM); Pin Count: 1; Family: Test Point; Socket: No; SMD: Yes; Sense: No; Status: None; ComponentHeight: 0mm; HelpURL: Undefined; Author: CERN DEM JLC; CreateDate: 12.01.2008; LatestRevisionDate: 12.01.2008; PackageDescription: 1.27mm x 1.27mm PCB Copper Area (SMD Test Point)